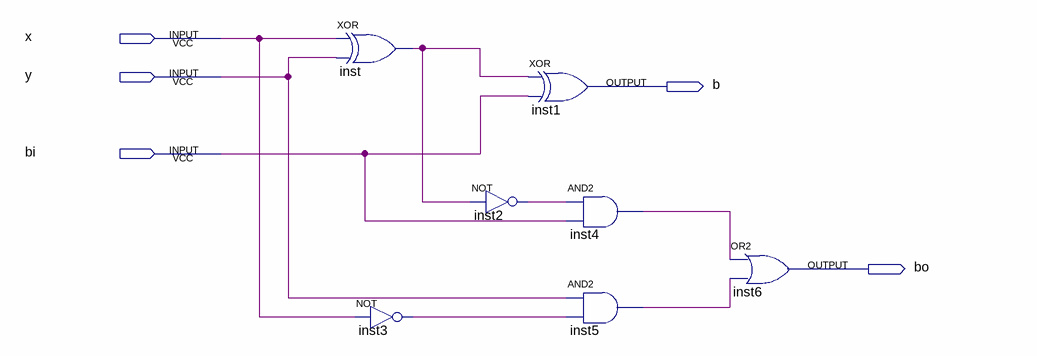
[diagram p0: schematic sheet]
// Quartus schematic full_sub_bdf.bdf as structural Verilog: 7 symbols, 5 pins
module full_sub_bdf (
  input  x,
  input  y,
  input  bi,
  output b,
  output bo
);

  wire inst2_out, inst3_out, inst4_out, inst5_out, inst_out;

  xor inst (inst_out, x, y);
  not inst3 (inst3_out, x);
  xor inst1 (b, inst_out, bi);
  not inst2 (inst2_out, inst_out);
  and inst4 (inst4_out, inst2_out, bi);
  and inst5 (inst5_out, y, inst3_out);
  or inst6 (bo, inst4_out, inst5_out);
endmodule
